# EAGLE design STorM32 Micro UsbPower v02 micro (EAGLE 7.5.0)
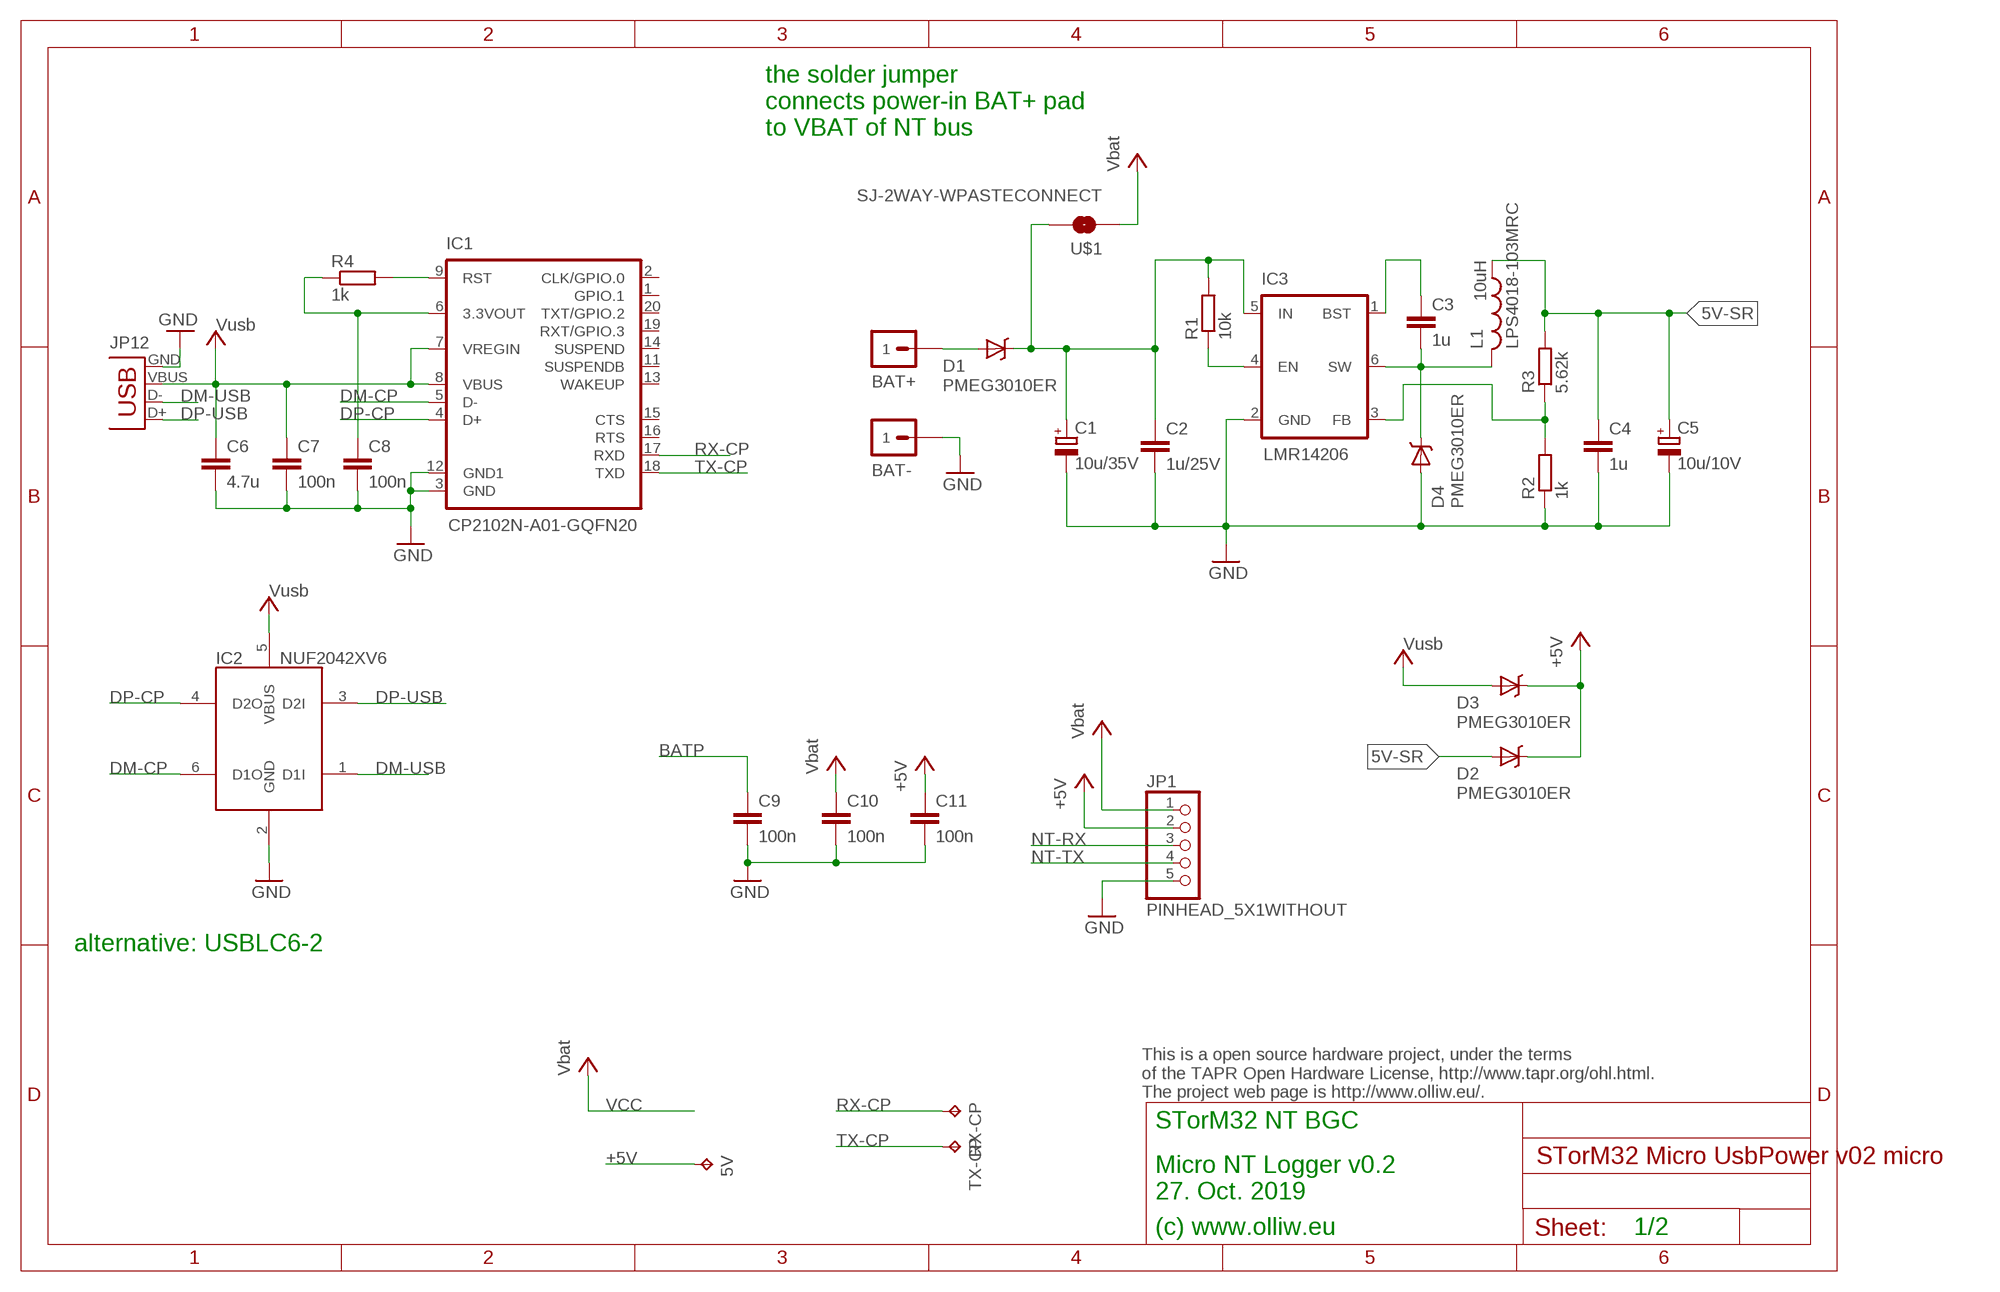
[diagram p0: schematic, sheet 1]

## Parts
5V  TPB1,27  [B1,27]
BAT+  M1X1  [1X1_WITHOUT]
BAT-  M1X1  [1X1_WITHOUT]
C1  10u/35V  CPOL-EUSMCB  [SMC_B]
C2  1u/25V  C-EUC0603  [C0603]
C3  1u  C-EUC0603  [C0603]
C4  1u  C-EUC0603  [C0603]
C5  10u/10V  CPOL-EUSMCA  [SMC_A]
C6  4.7u  C-EUC0603  [C0603]
C7  100n  C-EUC0402  [C0402]
C8  100n  C-EUC0402  [C0402]
C9  100n  C-EUC0603  [C0603]
C10  100n  C-EUC0603  [C0603]
C11  100n  C-EUC0402  [C0402]
D1  PMEG3010ER  DIODE-SCHOTTKYSOD123-W  [SOD123W-DIODE]
D2  PMEG3010ER  DIODE-SCHOTTKYSOD123-W  [SOD123W-DIODE]
D3  PMEG3010ER  DIODE-SCHOTTKYSOD123-W  [SOD123W-DIODE]
D4  PMEG3010ER  DIODE-SCHOTTKYSOD123-W  [SOD123W-DIODE]
IC1  CP2102N-A01-GQFN20  CP2102N-QFN20  [QFN20-CP2102N]
IC2  NUF2042XV6  [SOT563-6]
IC3  LMR14206  MP2359  [SOT23-6]
JP1  PINHEAD_5X1WITHOUT  [PINHEAD_5X1_WO]
L1  LPS4018-103MRC  L  [L4X4]
R1  10k  R-EU_R0402  [R0402]
R2  1k  R-EU_R0402  [R0402]
R3  5.62k  R-EU_R0402  [R0402]
R4  1k  R-EU_R0402  [R0402]
RX-CP  TPB1,27  [B1,27]
TX-CP  TPB1,27  [B1,27]
U$1  SJ-2WAY-WPASTECONNECT  [SJ-2WAY-BIG-WPASTEC]
USB  Amphenol 10118192-0001LF  USB-MICROB  [USB-MICROB]

## Nets
3.3V-CP2102: C8.1 IC1.6(3.3VOUT) R4.1
5V-SR: C4.1 C5.+ D2.A L1.1 R3.2
+5V: 5V.TP C11.1 D2.C D3.C JP1.2
BATP: BAT+.1 C9.1 D1.A
DM-CP: IC1.5(D-) IC2.6(D1O)
DM-USB: IC2.1(D1I) USB.D-
DP-CP: IC1.4(D+) IC2.4(D2O)
DP-USB: IC2.3(D2I) USB.D+
GND: BAT-.1 C1.- C2.2 C4.2 C5.- C6.2 C7.2 C8.2 C9.2 C10.2 C11.2 D4.A IC1.3(GND) IC1.12(GND1) IC2.2(GND) IC3.2(GND) JP1.5 R2.1 USB.GND
N$5: C1.+ C2.1 D1.C IC3.5(IN) R1.2 U$1.2
N$7: IC3.4(EN) R1.1
N$13: C3.1 IC3.1(BST)
N$14: IC3.3(FB) R2.2 R3.1
N$15: C3.2 D4.C IC3.6(SW) L1.2
N$18: IC1.9(RST) R4.2
NT-RX: JP1.3
NT-TX: JP1.4
RX-CP: IC1.17(RXD) RX-CP.TP
TX-CP: IC1.18(TXD) TX-CP.TP
VCC: C10.1 JP1.1 U$1.1 ; supply symbol labelled Vbat
VUSB: C6.1 C7.1 D3.A IC1.7(VREGIN) IC1.8(VBUS) IC2.5(VBUS) USB.VBUS ; supply symbol labelled Vusb
Unconnected: IC1.1(GPIO.1) IC1.2(CLK/GPIO.0) IC1.11(SUSPENDB) IC1.13(WAKEUP) IC1.14(SUSPEND) IC1.15(CTS) IC1.16(RTS) IC1.19(RXT/GPIO.3) IC1.20(TXT/GPIO.2)

## Notes on the sheet
- the solder jumper
  connects power-in BAT+ pad
  to VBAT of NT bus
- 10uH
- JP12
- alternative: USBLC6-2
- This is a open source hardware project, under the terms
  of the TAPR Open Hardware License, http://www.tapr.org/ohl.html.
  The project web page is http://www.olliw.eu/.
- STorM32 NT BGC
- Micro NT Logger v0.2
  27. Oct. 2019
- (c) www.olliw.eu | 1/2

## Library data of the parts
5V RX-CP TX-CP = testpad:TP: Test pad
BAT+ BAT- = # stdlib:M1X1
C1 C5 = rcl:CPOL-EU: POLARIZED CAPACITOR, European symbol
C2-C4 C6-C11 = rcl:C-EU: CAPACITOR, European symbol
D1-D4 = # stdlib:DIODE-SCHOTTKY
IC1 = # stdlib:CP2102N-QFN20
IC2 = #z pixhawk2:NUF2042XV6
IC3 = # stdlib:MP2359
JP1 = # stdlib:PINHEAD_5X1
L1 = # stdlib:L
R1-R4 = rcl:R-EU_: RESISTOR, European symbol
U$1 = # stdlib:SJ-2WAY
USB = # SparkFun2:USB: USB Connectors USB-B-PTH is fully proven SKU : PRT-00139 USB-miniB is fully proven SKU : PRT-00587 USB-A-PCB is untested. USB-A-H is throughly reviewed, but untested. Spark Fun Electronics SKU : PRT-00437 USB-B-SMT is throughly reviewed, but untested. Needs silkscreen touching up. USB-A-S has not been used/tested USB-MB-H has not been used/tested

## Board
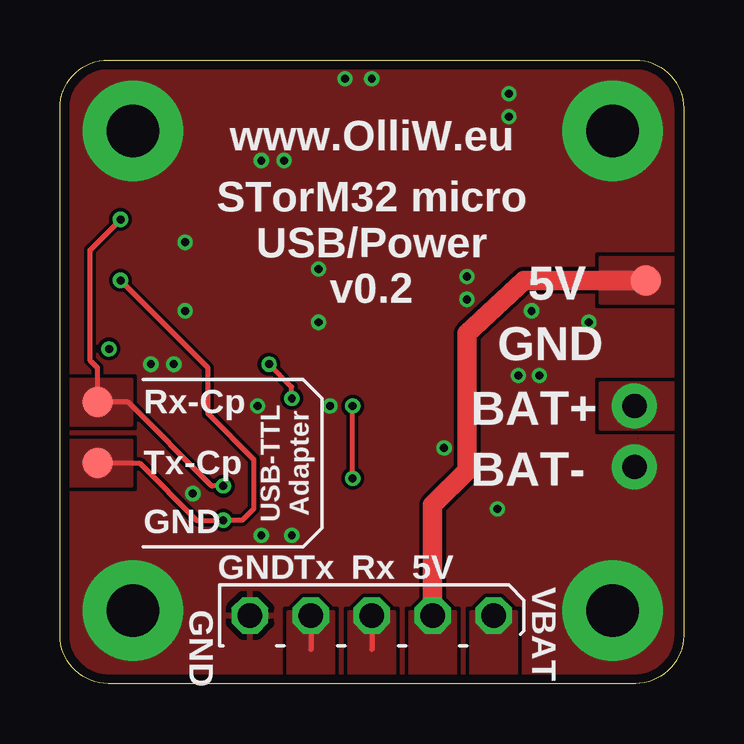
[diagram p1: board, top side]
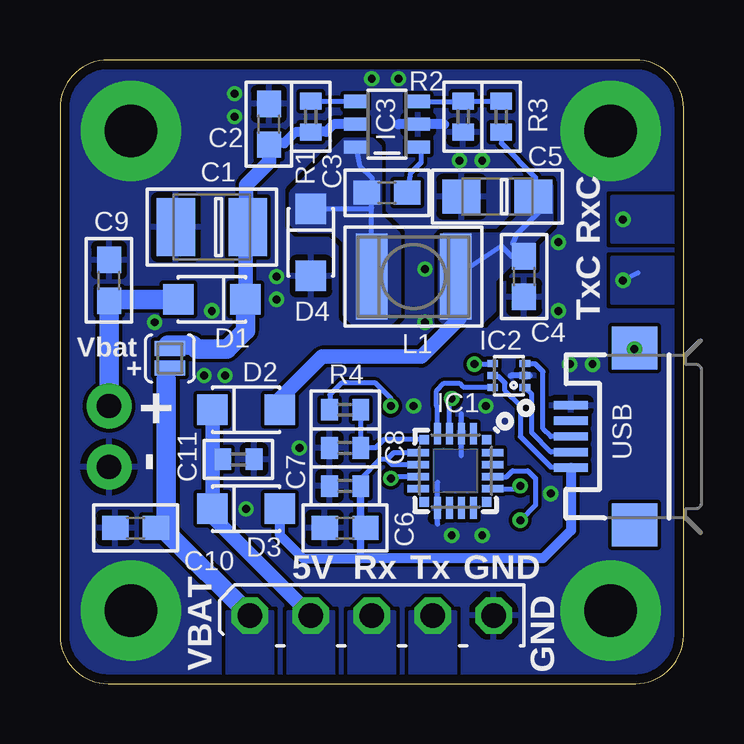
[diagram p2: board, bottom side, seen from below]

Size 26 x 26 mm. Coordinates in mm from the lower left corner, seen from the top.
Outline: 24,0 2,0 arc-90 0,2 0,24 arc-90 2,26 24,26 arc-90 26,24 26,2 arc-90 24,0
Copper layers (1*16): Top 0.035mm / dielectric 1.5mm / Bottom 0.035mm
Design rules "ShenZhen2U_2layer_EagleRules *": minimum track width 6mil, minimum drill 12mil, track to track 6mil, track to pad 6mil, pad to pad 6mil, via to via 6mil, smd to smd 0mil, copper to edge 15mil, drill to drill 10mil, minimum pad ring 10mil, minimum via ring 6mil, stop-mask expansion 2mil, vias tented up to drill 25mil, thermal gap 10mil

### Footprints (pad centres in the part's own frame; a part is rotated, then mirrored left to right if it is on the bottom)
B1,27 = smd 1.27 x 1.27: TP 0,0
1X1_WITHOUT = drill 1.016 pad 1.88: 1 0,0
SMC_B = smd 1.6 x 2.4: + -1.5,0; - 1.5,0
C0603 = smd 1.1 x 1: 1 -0.85,0; 2 0.85,0
SMC_A = smd 1.6 x 1.4: + -1.5,0; - 1.5,0
C0402 = smd 0.7 x 0.9: 1 -0.65,0; 2 0.65,0
SOD123W-DIODE = smd 1.27 x 1.27: A -1.4,0; C 1.4,0
QFN20-CP2102N = smd 0.4 x 0.4: 1 -1.3,1.3; 6 -1.3,-1.3; 11 1.3,-1.3; 16 1.3,1.3 | smd 0.9 x 0.3: 2 -1.55,0.75; 3 -1.55,0.25; 4 -1.55,-0.25; 5 -1.55,-0.75; 12 1.55,-0.75; 13 1.55,-0.25; 14 1.55,0.25; 15 1.55,0.75 | smd 0.3 x 0.9: 7 -0.75,-1.55; 8 -0.25,-1.55; 9 0.25,-1.55; 10 0.75,-1.55; 17 0.75,1.55; 18 0.25,1.55; 19 -0.25,1.55; 20 -0.75,1.55
SOT563-6 = smd 0.3 x 0.45: 1 -0.5,-0.675; 2 0,-0.675; 3 0.5,-0.675; 4 0.5,0.675; 5 0,0.675; 6 -0.5,0.675
SOT23-6 = smd 0.55 x 0.99: 1 -0.95,-1.3; 2 0,-1.3; 3 0.95,-1.3; 4 0.95,1.3; 5 0,1.3; 6 -0.95,1.3
PINHEAD_5X1_WO = drill 1.016 octagon: 1 0,0; 2 0,-2.54; 3 0,-5.08; 4 0,-7.62; 5 0,-10.16
L4X4 = smd 1.3 x 3.6: 1 -1.75,0; 2 1.75,0
R0402 = smd 0.7 x 0.9: 1 -0.65,0; 2 0.65,0
SJ-2WAY-BIG-WPASTEC = smd 0.635 x 1.27: 1 -0.4,0; 2 0.413,0
USB-MICROB = smd 0.35 x 1.4: D+ 0,2.65; D- -0.65,2.65; GND 1.3,2.65; ID 0.65,2.65; VBUS -1.3,2.65 | smd 1.8 x 1.9: MT1 -3.683,0; MT2 3.683,0

### Placement (x,y rotation side)
5V  24.43,16.81 0 top
BAT+  23.95,11.57 0 top
BAT-  23.95,9.03 0 top
C1  19.67,19.03 180 bottom
C2  17.29,23.32 90 bottom
C3  12.37,20.46 180 bottom
C4  6.65,16.97 270 bottom
C5  7.76,20.3 180 bottom
C6  14.11,6.49 180 bottom
C7  14.11,8.24 180 bottom
C8  14.11,9.82 180 bottom
C9  23.95,16.81 90 bottom
C10  22.84,6.49 180 bottom
C11  18.56,9.35 0 bottom
D1  19.67,16.02 0 bottom
D2  18.24,11.41 180 bottom
D3  18.24,7.29 180 bottom
D4  15.54,18.4 90 bottom
IC1  9.51,8.87 270 bottom
IC2  7.29,12.84 90 bottom
IC3  12.37,23.32 90 bottom
JP1  18.08,2.84 270 top
L1  11.25,16.97 180 bottom
R1  15.54,23.64 270 bottom
R2  9.19,23.64 90 bottom
R3  7.6,23.64 270 bottom
R4  14.11,11.41 180 bottom
RX-CP  1.57,11.73 0 top
TX-CP  1.57,9.19 0 top
U$1  21.41,13.56 90 bottom
USB  2.05,10.3 90 bottom

### Tracks (layer width: path | path; a pad name or v marks a point on that pad's centre or on a via)
3.3V-CP2102
  Bottom 0.203: IC1.6 12.49,10.17 12.84,9.82 C8.1 R4.1
5V-SR
  Bottom 0.203: R3.2 7.6,22.52 6.17,21.1 6.17,20.53 C5.+ 5.94,19.74 6.97,18.71 7.13,18.34 C4.1 7.18,17.82 7.6,18.24 L1.1
  Bottom 0.406: 16.97,11.73 D2.A
  Bottom 0.61: L1.1 9.34,15.23 10.94,13.63 15.06,13.63 16.97,11.73
  pour Bottom (no thermals): 5.54,20.78 5.54,19.19 7.92,16.81 7.92,15.54 8.4,15.06 9.98,15.06 10.14,15.22 10.14,18.56 9.98,18.71 7.6,18.71 6.81,19.51 6.81,20.78 6.65,20.94 5.7,20.94
+5V
  Top 0.813: 5V.TP 19.35,16.81 16.97,14.59 16.97,8.87 15.54,7.44 JP1.2
  Bottom 0.203: 19.67,7.26 D3.C | C11.1 19.64,9.67
  Bottom 0.406: 19.83,7.13 19.67,7.26
  Bottom 0.61: JP1.2 19.83,7.13 | D3.C 19.64,9.67 D2.C
  pour Top (isolate 0.305, no thermals): 22.52,17.76 25.7,17.76 25.7,15.86 22.52,15.86
  pour Top (isolate 0.305, no thermals): 14.59,0.14 14.59,3 16.49,3 16.49,0.14
  pour Bottom (isolate 0.305, no thermals): 14.59,3 14.59,0.14 16.49,0.06 16.49,3
BATP
  Bottom 0.61: 23.9,16.02 C9.1
  Bottom 0.813: BAT+.1 C9.1 | D1.A 23.9,16.02
  pour Top (isolate 0.305, no thermals): 22.52,12.52 25.7,12.52 25.7,10.62 22.52,10.62
DM-CP
  Bottom 0.203: IC1.5 10.26,11.53 10.3,11.57 10.3,12.21 9.98,12.52 9.35,12.52 9.19,12.37 7.83,12.37 IC2.6
DM-USB
  Bottom 0.203: USB.D- 5.52,9.65 6.33,10.46 6.33,12.06 IC2.1
DP-CP  (via drill 0.33)
  Top 0.203: v9.67,11.89 9.67,12.37 v8.71,13.32
  Bottom 0.203: IC1.4 9.76,11.8 v9.67,11.89 | v8.71,13.32 7.94,13.32 IC2.4
DP-USB
  Bottom 0.203: USB.D+ 5.54,10.3 5.86,10.62 5.86,13 6.2,13.34 IC2.3
GND  (via drill 0.33, 2.2 pad 4.2)
  Bottom 0.203: 9.27,9.51 9.27,11.25 | 10.25,6.65 10.25,8.4
  Bottom 0.254: 6.41,12.84 7.21,12.84
  Bottom 0.406: 9.98,23.32 11.89,23.32
  other vias: 3.04,3.04 23.04,3.04 3.04,23.04 23.04,23.04 11.25,11.57 9.67,6.17 8.24,11.57 13,25.22 10.78,17.29 10.78,15.06 16.97,16.97 16.97,16.02 9.35,21.81 8.4,21.81 11.89,25.22 18.72,24.59 18.72,23.64 5.22,18.4 5.22,15.54 5.54,7.92 4.75,13.32 3.79,13.32 22.05,15.06 19.67,15.54 18.24,7.29 16.02,9.82 19.11,12.84 19.98,12.84 8.4,6.17
  pour Top (isolate 0.152, rank 6): -0.97,-0.97 -0.97,26.97 26.97,26.97 26.97,-0.97
  pour Bottom (isolate 0.152, rank 6): -0.34,-0.34 -0.34,26.34 26.34,26.34 26.34,-0.34
  pour Top (no thermals): 22.52,10.14 25.7,10.14 25.7,7.76 22.52,7.76
N$3  (via drill 0.33)
  other vias: 2.05,13.95
N$5
  Bottom 0.203: 15.37,23 R1.2 | 17.23,22.52 C2.1 | 18.27,18.93 C1.+ 18.24,19.1
  Bottom 0.305: 21.51,13.79 U$1.2 21.83,13.79 21.49,14.11
  Bottom 0.406: IC3.5 14.59,23.32 14.91,23 15.37,23 | R1.2 16.19,22.99 16.65,22.52 17.23,22.52
  Bottom 0.61: D1.C 18.27,18.93 | C2.1 17.29,21.73 18.24,20.78 18.24,19.1
  Bottom 0.813: D1.C 18.27,14.72 19.03,13.95 20.3,13.95 20.46,14.11 21.49,14.11
N$7
  Bottom 0.203: IC3.4 15.36,24.27 R1.1
N$13
  Bottom 0.203: C3.1 11.36,21.31 10.94,21.73 10.94,22.34 IC3.1
N$14
  Bottom 0.203: IC3.3 9.05,24.27 R2.2 R3.1
N$15
  Bottom 0.203: IC3.6 13.51,21.6 13,21.1 13,20.41 C3.2 13,20.41 13,19.83 | L1.2 13,19.83 | D4.C 13.03,19.8 13,19.83
  pour Bottom (no thermals): 13,22.68 12.68,22.37 12.68,19.51 11.89,18.71 11.89,15.38 12.21,15.06 13.79,15.06 14.11,15.38 14.11,18.4 14.59,18.87 16.02,18.87 16.33,19.19 16.33,20.46 14.11,22.68
N$18  (via drill 0.33)
  Top 0.203: v12.21,8.55 v12.21,11.57
  Bottom 0.203: IC1.9 12.14,8.62 v12.21,8.55 | v12.21,11.57 12.21,11.89 12.84,12.52 14.27,12.52 14.75,12.05 14.75,11.43 R4.2
NT-RX
  Top 0.203: JP1.3 13,1.41
  pour Top (isolate 0.305, no thermals): 12.05,0.14 12.05,3 13.95,3 13.95,0.14
  pour Bottom (isolate 0.305, no thermals): 12.05,3 12.05,0.14 13.95,0.06 13.95,3
NT-TX
  Top 0.203: JP1.4 10.46,1.41
  pour Top (isolate 0.305, no thermals): 9.51,0.14 9.51,3 11.41,3 11.41,0.14
  pour Bottom (isolate 0.305, no thermals): 9.51,3 9.51,0.14 11.41,0.06 11.41,3
RX-CP  (via drill 0.33)
  Top 0.203: v6.81,8.24 6.33,8.24 2.84,11.73 RX-CP.TP 1.57,13.16 1.25,13.48 1.25,18.08 v2.52,19.35
  Bottom 0.203: IC1.17 6.92,8.12 v6.81,8.24 | v2.52,19.35 2.36,19.51
  pour Top (isolate 0.305, no thermals): 3,12.68 0.14,12.68 0.06,10.78 3,10.78
  pour Bottom (isolate 0.305, no thermals): 3,20.3 0.14,20.3 0.06,18.4 3,18.4
TX-CP  (via drill 0.33)
  Top 0.203: TX-CP.TP 3.32,9.19 5.7,6.81 v6.81,6.81 7.6,6.81 8.08,7.29 8.08,9.35 6.17,11.25 6.17,13.16 v2.52,16.81
  Bottom 0.203: v6.81,6.81 6.17,7.44 6.17,8.55 6.49,8.87 7.13,8.87 7.38,8.62 IC1.18 | v2.52,16.81 1.89,17.13
  pour Top (isolate 0.305, no thermals): 0.14,10.14 3,10.14 3,8.24 0.14,8.24
  pour Bottom (isolate 0.305, no thermals): 3,17.76 0.14,17.76 0.06,15.86 3,15.86
VCC
  Bottom 0.203: C10.1 21.57,6.33
  Bottom 0.406: 21.57,12.68 U$1.1
  Bottom 0.813: 21.57,12.68 21.57,6.33 JP1.1
  pour Top (isolate 0.305, no thermals): 17.13,0.14 17.13,3 19.03,3 19.03,0.14
  pour Bottom (isolate 0.305, no thermals): 17.13,3 17.13,0.14 19.03,0.06 19.03,3
VUSB
  Bottom 0.203: 13.46,6.53 C6.1 13.26,6.39 13.48,6.17 | IC1.7 12.09,9.62 12.37,9.35 | 12.37,9.35 12.68,9.35 13.48,8.54 C7.1 | IC1.8 12.14,9.12 12.37,9.35 | USB.VBUS 4.73,9.03 5.54,9.03 6.81,10.3 6.81,11.57 7.44,12.21 7.44,12.52 7.76,12.84 IC2.5
  Bottom 0.305: C7.1 13.46,6.53 | 13.48,6.17 13.48,5.22
  Bottom 0.406: USB.VBUS 4.7,6.38 5.86,5.22 13.48,5.22 15.86,5.22 16.84,6.2 D3.A

### Text on the board
tNames: www.OlliW.eu | STorM32 micro / USB/Power / v0.2 | GND | Rx-Cp | Tx-Cp | USB-TTL / Adapter | GND | GND | Tx | Rx | 5V | VBAT | GND
bNames: RxC | TxC | Vbat | + | + | - | GND | Tx | Rx | 5V | GND | VBAT